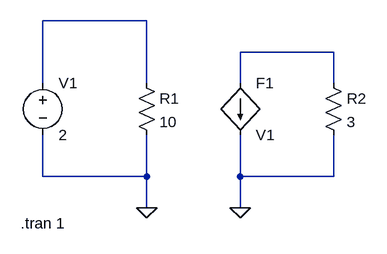
[diagram p0: schematic cccs.asc]
cccs.asc, the LTspice schematic file:
Version 4
SHEET 1 880 680
WIRE 256 32 96 32
WIRE 544 80 400 80
WIRE 96 128 96 32
WIRE 256 128 256 32
WIRE 400 128 400 80
WIRE 544 128 544 80
WIRE 96 272 96 208
WIRE 256 272 256 208
WIRE 256 272 96 272
WIRE 400 272 400 208
WIRE 544 272 544 208
WIRE 544 272 400 272
WIRE 256 320 256 272
WIRE 400 320 400 272
FLAG 256 320 0
FLAG 400 320 0
SYMBOL voltage 96 112 R0
WINDOW 123 0 0 Left 0
WINDOW 39 0 0 Left 0
SYMATTR InstName V1
SYMATTR Value 2
SYMBOL res 240 112 R0
SYMATTR InstName R1
SYMATTR Value 10
SYMBOL res 528 112 R0
SYMATTR InstName R2
SYMATTR Value 3
SYMBOL f 400 128 R0
SYMATTR InstName F1
SYMATTR Value V1
SYMATTR Value2 1
TEXT 62 344 Left 2 !.tran 1

The netlist it stands for:
* cccs.asc
V1 N001 0 2
R1 N001 0 10
R2 N002 0 3
F1 N002 0 V1 1
.tran 1
.backanno
.end